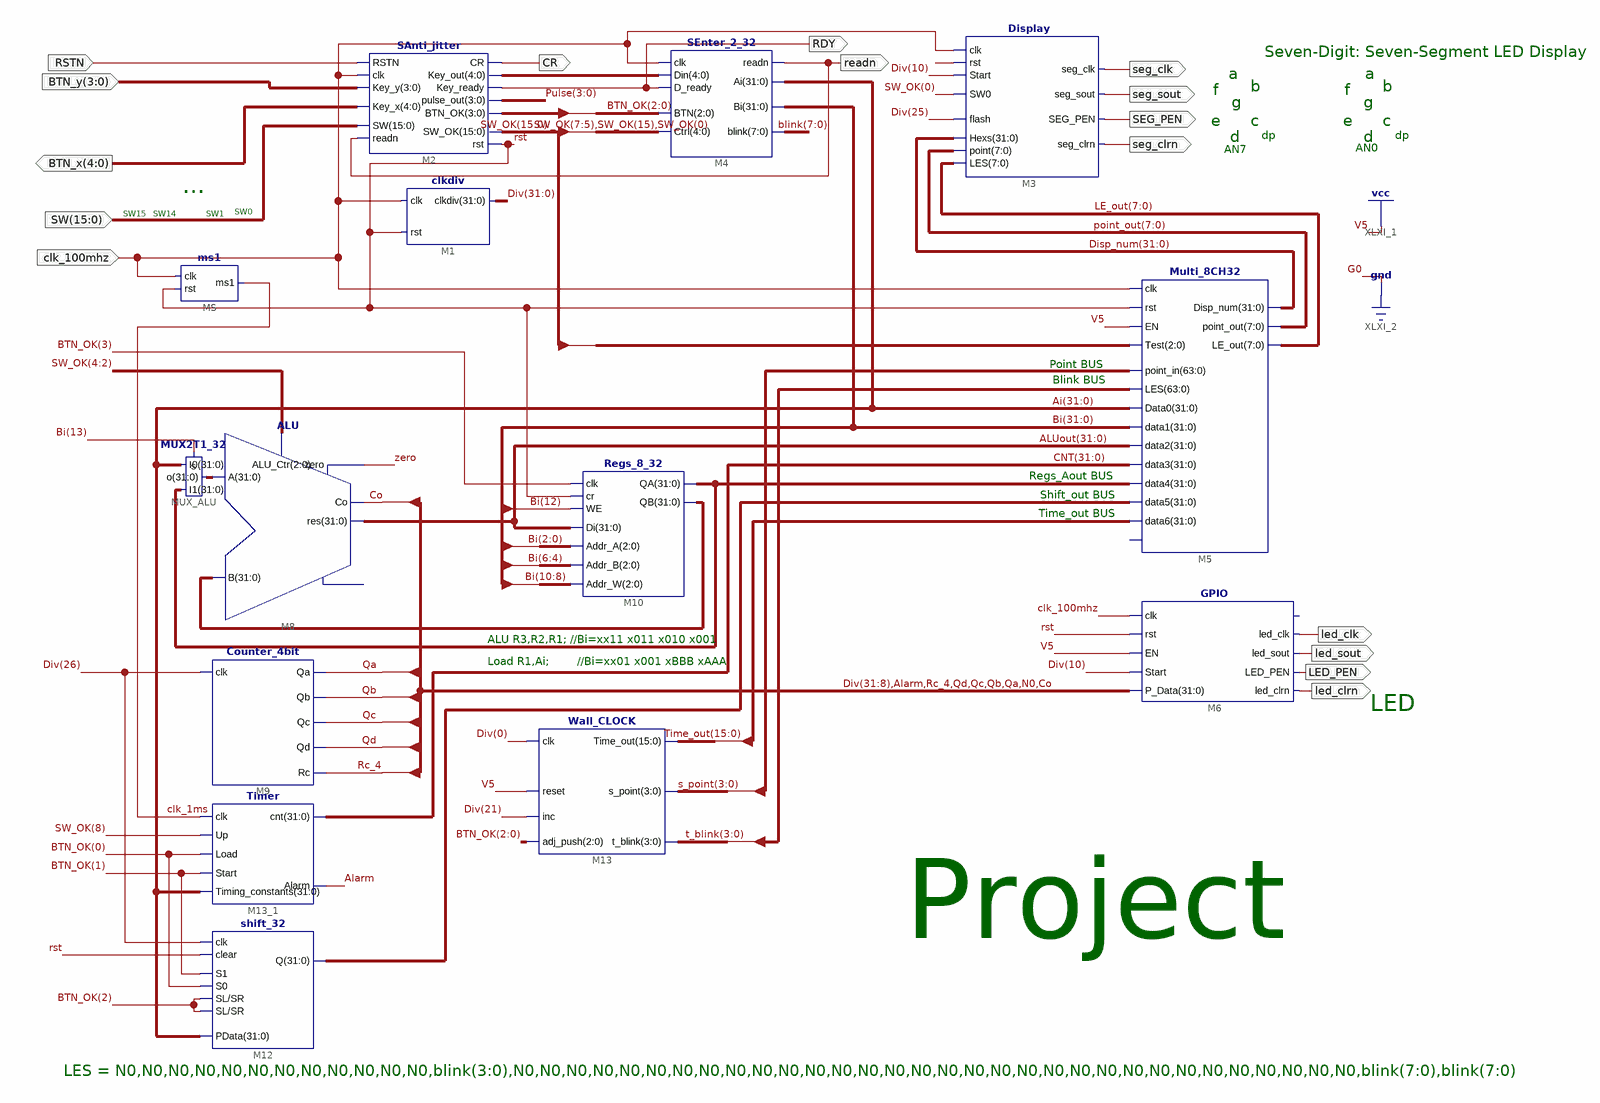
[diagram p0: schematic sheet 1]
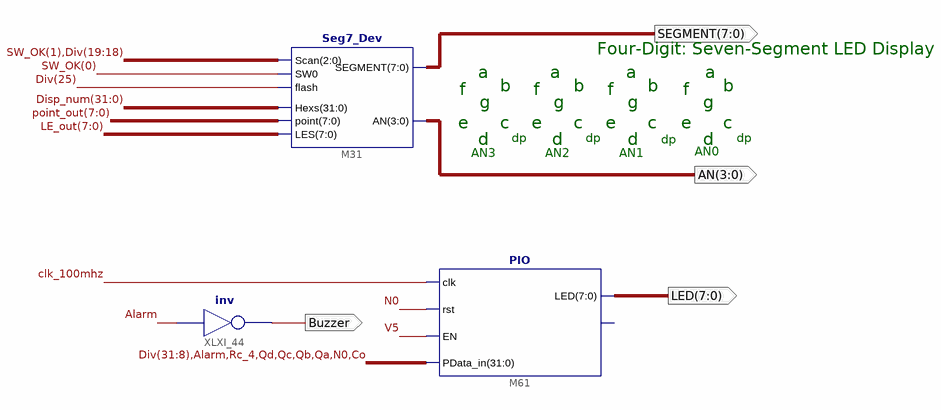
[diagram p1: schematic sheet 2]
// Xilinx ISE schematic Top_WallClock.sch (kintex7) as structural Verilog: 17 symbols, 20 ports
module Top_WallClock (
  input  clk_100mhz,
  input  [15:0] SW,
  input  [3:0] BTN_y,
  input  RSTN,
  output seg_clk,
  output seg_sout,
  output SEG_PEN,
  output seg_clrn,
  output readn,
  output RDY,
  output [4:0] BTN_x,
  output CR,
  output [7:0] SEGMENT,
  output [3:0] AN,
  output Buzzer,
  output [7:0] LED,
  output led_clrn,
  output LED_PEN,
  output led_clk,
  output led_sout
);

  wire Alarm, clk_1ms, Co, N0, Qa, Qb, Qc, Qd, Rc_4, rst, zero;
  wire [3:0] BTN_OK, Pulse, s_point, t_blink;
  wire [4:0] XLXN_444;
  wire [7:0] blink, LE_out, point_out;
  wire [15:0] SW_OK, Time_out;
  wire [31:0] Ai, ALUout, Bi, CNT, Disp_num, Div, XLXN_486, XLXN_488, XLXN_517, XLXN_676;

  SAnti_jitter M2 (
    .SW(SW), .readn(readn), .Key_y(BTN_y), .Key_x(BTN_x), .RSTN(RSTN), .clk(clk_100mhz), .Key_out(XLXN_444),
    .Key_ready(RDY), .CR(CR), .rst(rst), .SW_OK(SW_OK), .pulse_out(Pulse), .BTN_OK(BTN_OK));
  SEnter_2_32 M4 (
    .readn(readn), .Ai(Ai), .Bi(Bi), .blink(blink), .Din(XLXN_444), .D_ready(RDY), .clk(clk_100mhz),
    .Ctrl({SW_OK[7:5], SW_OK[15], SW_OK[0]}), .BTN(BTN_OK[2:0]));
  clkdiv M1 (.rst(rst), .clkdiv(Div), .clk(clk_100mhz));
  Display M3 (
    .LES(LE_out), .SEG_PEN(SEG_PEN), .seg_sout(seg_sout), .seg_clrn(seg_clrn), .point(point_out),
    .Hexs(Disp_num), .SW0(SW_OK[0]), .flash(Div[25]), .seg_clk(seg_clk), .clk(clk_100mhz), .rst(rst),
    .Start(Div[10]));
  Seg7_Dev M31 (
    .LES(LE_out), .Scan({SW_OK[1], Div[19:18]}), .SEGMENT(SEGMENT), .AN(AN), .point(point_out),
    .flash(Div[25]), .SW0(SW_OK[0]), .Hexs(Disp_num));
  Multi_8CH32 M5 (
    .Test(SW_OK[7:5]), .point_in({{12{N0}}, s_point, {16{N0}}, Div}), .EN(1'b1), .clk(clk_100mhz), .rst(rst),
    .LES({{12{N0}}, t_blink, {32{N0}}, blink[3:0], blink[3:0], blink}), .Data0(Ai), .data1(Bi),
    .data2(ALUout), .data3(CNT), .data4(XLXN_488), .data5(XLXN_676), .data6({{16{N0}}, Time_out}),
    .point_out(point_out), .LE_out(LE_out), .Disp_num(Disp_num));  // open: data7
  PIO M61 (
    .clk(clk_100mhz), .rst(N0), .EN(1'b1), .PData_in({Div[31:8], Alarm, Rc_4, Qd, Qc, Qb, Qa, N0, Co}),
    .LED(LED));  // open: GPIOf0
  not XLXI_44 (Buzzer, Alarm);
  ms1 MS (.clk(clk_100mhz), .rst(rst), .ms1(clk_1ms));
  Regs_8_32 M10 (
    .QA(XLXN_488), .clk(BTN_OK[3]), .cr(rst), .WE(Bi[12]), .QB(XLXN_486), .Di(ALUout), .Addr_W(Bi[10:8]),
    .Addr_B(Bi[6:4]), .Addr_A(Bi[2:0]));
  MUX2T1_32 MUX_ALU (.s(Bi[13]), .I0(Ai), .I1(XLXN_488), .o(XLXN_517));
  ALU M8 (.A(XLXN_517), .B(XLXN_486), .res(ALUout), .zero(zero), .Co(Co), .ALU_Ctr(SW_OK[4:2]));  // open: overflow
  Timer M13_1 (
    .clk(clk_1ms), .Alarm(Alarm), .cnt(CNT), .Timing_constants(Ai), .Up(SW_OK[8]), .Load(BTN_OK[0]),
    .Start(BTN_OK[1]));
  Counter_4bit M9 (.clk(Div[26]), .Qa(Qa), .Qb(Qb), .Qc(Qc), .Qd(Qd), .Rc(Rc_4));
  shift_32 M12 (
    .Q(XLXN_676), .PData(Ai), .clk(Div[26]), .clear(rst), .S0(BTN_OK[0]), .S1(BTN_OK[1]), .SL(BTN_OK[2]),
    .SR(BTN_OK[2]));
  GPIO M6 (
    .clk(clk_100mhz), .P_Data({Div[31:8], Alarm, Rc_4, Qd, Qc, Qb, Qa, N0, Co}), .rst(rst), .EN(1'b1),
    .Start(Div[10]), .led_clrn(led_clrn), .led_clk(led_clk), .led_sout(led_sout), .LED_PEN(LED_PEN));  // open: GPIOf0
  Wall_CLOCK M13 (
    .clk(Div[0]), .reset(1'b1), .inc(Div[21]), .adj_push(BTN_OK[2:0]), .Time_out(Time_out),
    .s_point(s_point), .t_blink(t_blink));

  // Notes on the sheet:
  //   Seven-Digit: Seven-Segment LED Display
  //   a
  //   a
  //   b
  //   b
  //   f
  //   f
  //   g
  //   g
  //   e
  //   c
  //   e
  //   c
  //   dp
  //   dp
  //   d
  //   d
  //   AN0
  //   AN7
  //   ...
  //   SW0
  //   SW15
  //   SW14
  //   SW1
  //   Point BUS
  //   Blink BUS
  //   Regs_Aout BUS
  //   Shift_out BUS
  //   Time_out BUS
  //   ALU R3,R2,R1; //Bi=xx11 x011 x010 x001
  //   Load R1,Ai;        //Bi=xx01 x001 xBBB xAAA
  //   LED
  //   Project
  //   LES = N0,N0,N0,N0,N0,N0,N0,N0,N0,N0,N0,N0,blink(3:0),N0,N0,N0,N0,N0,N0,N0,N0,N0,N0,N0,N0,N0,N0,N0,N0,N0,N0,N0,N0,N0,N0,N0,N0,N0,N0,N0,N0,N0,N0,N0,N0,blink(7:0),blink(7:0)
  //   Four-Digit: Seven-Segment LED Display
  //   a
  //   a
  //   a
  //   a
  //   b
  //   b
  //   b
  //   b
  //   f
  //   f
  //   f
  //   f
  //   g
  //   g
  //   g
  //   g
  //   e
  //   c
  //   e
  //   c
  //   e
  //   c
  //   e
  //   c
  //   dp
  //   dp
  //   dp
  //   d
  //   d
  //   d
  //   dp
  //   d
  //   AN0
  //   AN3
  //   AN2
  //   AN1
  //   LOC on signal clk_100mhz = t9
endmodule
